# EAGLE design kbd (EAGLE 7.7.0)
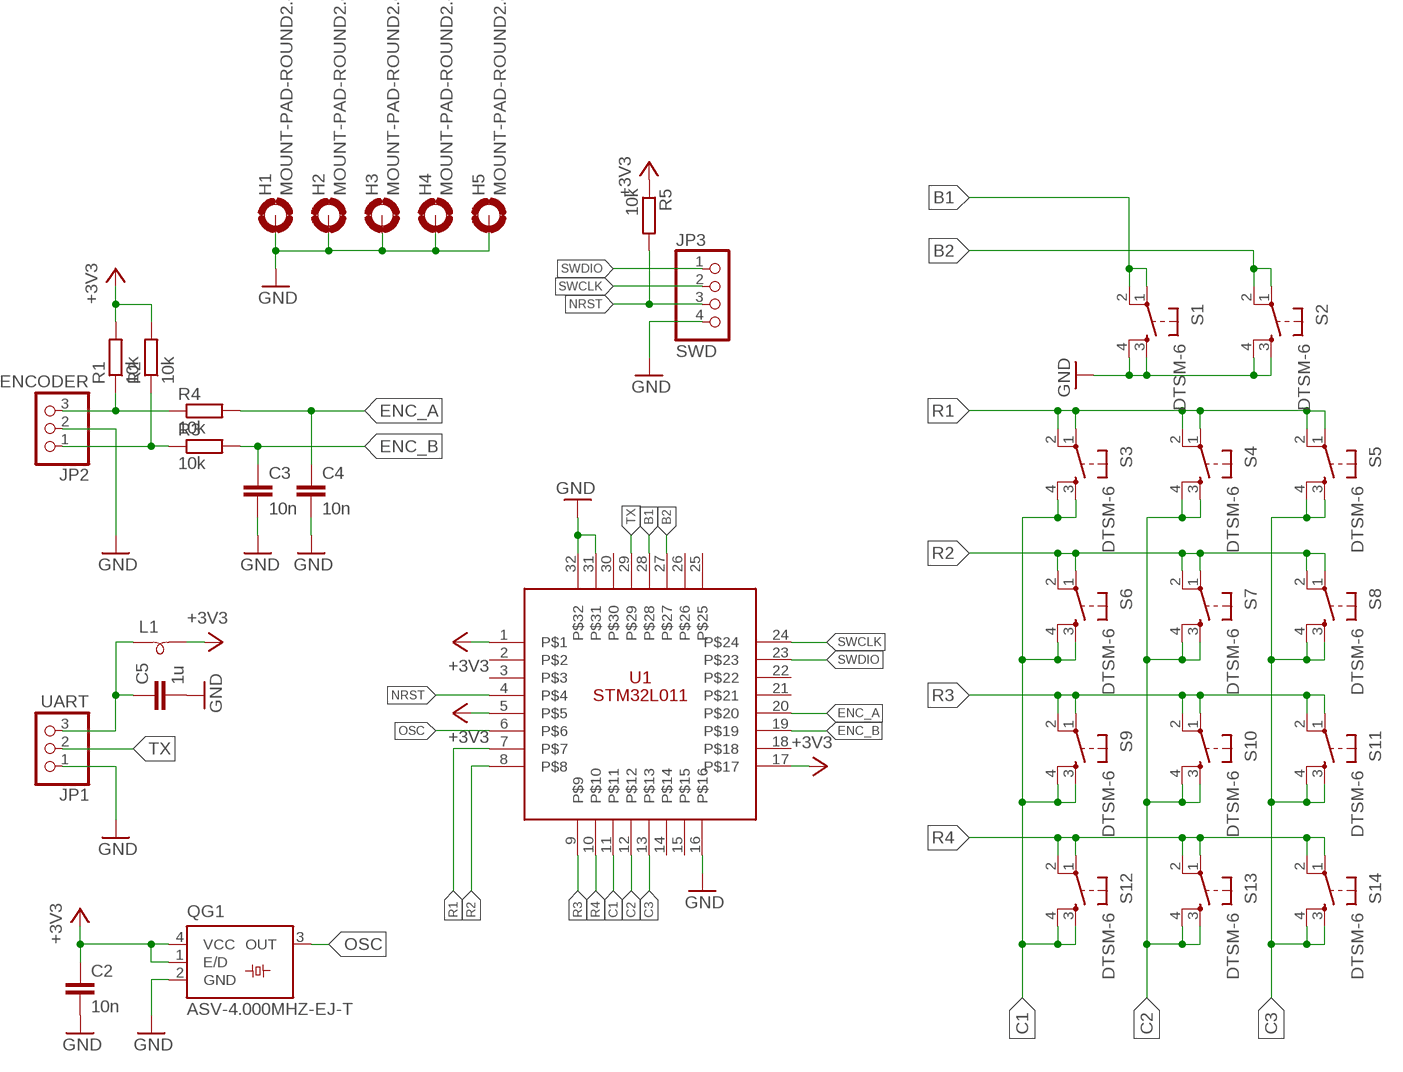
[diagram p0: schematic, sheet 1]

## Parts
C2  10n  C-EUC0805  [C0805]
C3  10n  C-EUC0805  [C0805]
C4  10n  C-EUC0805  [C0805]
C5  1u  C-EUC1206  [C1206]
H1  MOUNT-PAD-ROUND2.8  [2,8-PAD]
H2  MOUNT-PAD-ROUND2.8  [2,8-PAD]
H3  MOUNT-PAD-ROUND2.8  [2,8-PAD]
H4  MOUNT-PAD-ROUND2.8  [2,8-PAD]
H5  MOUNT-PAD-ROUND2.8  [2,8-PAD]
JP1  UART  PINHD-1X3  [1X03]
JP2  ENCODER  PINHD-1X3  [1X03]
JP3  SWD  PINHD-1X4  [1X04]
L1  SM-B5  [SM-B5]
QG1  ASV-4.000MHZ-EJ-T  SM77H  [SM77H]
R1  10k  R-EU_R0805  [R0805]
R2  10k  R-EU_R0805  [R0805]
R3  10k  R-EU_R0805  [R0805]
R4  10k  R-EU_R0805  [R0805]
R5  10k  R-EU_R0805  [R0805]
S1  DTSM-6  [DTSM-6]
S2  DTSM-6  [DTSM-6]
S3  DTSM-6  [DTSM-6]
S4  DTSM-6  [DTSM-6]
S5  DTSM-6  [DTSM-6]
S6  DTSM-6  [DTSM-6]
S7  DTSM-6  [DTSM-6]
S8  DTSM-6  [DTSM-6]
S9  DTSM-6  [DTSM-6]
S10  DTSM-6  [DTSM-6]
S11  DTSM-6  [DTSM-6]
S12  DTSM-6  [DTSM-6]
S13  DTSM-6  [DTSM-6]
S14  DTSM-6  [DTSM-6]
U1  STM32L011  [LQFP32-7X7]

## Nets
+3V3: C2.1 L1.2 QG1.1(E/D) QG1.4(VCC) R1.2 R2.2 R5.1 U1.1 U1.5 U1.17
B1: S1.1 S1.2 U1.28
B2: S2.1 S2.2 U1.27
C1: S3.3 S3.4 S6.3 S6.4 S9.3 S9.4 S12.3 S12.4 U1.11
C2: S4.3 S4.4 S7.3 S7.4 S10.3 S10.4 S13.3 S13.4 U1.12
C3: S5.3 S5.4 S8.3 S8.4 S11.3 S11.4 S14.3 S14.4 U1.13
ENC_A: C4.1 R4.2 U1.20
ENC_B: C3.1 R3.2 U1.19
GND: C2.2 C3.2 C4.2 C5.2 H1.B2,8(MOUNT) H2.B2,8(MOUNT) H3.B2,8(MOUNT) H4.B2,8(MOUNT) H5.B2,8(MOUNT) JP1.1 JP2.2 JP3.4 QG1.2(GND) S1.3 S1.4 S2.3 S2.4 U1.16 U1.31 U1.32
N$1: JP2.3 R1.1 R4.1
N$2: JP2.1 R2.1 R3.1
N$3: C5.1 JP1.3 L1.1
NRST: JP3.3 R5.2 U1.4
OSC: QG1.3(OUT) U1.6
R1: S3.1 S3.2 S4.1 S4.2 S5.1 S5.2 U1.7
R2: S6.1 S6.2 S7.1 S7.2 S8.1 S8.2 U1.8
R3: S9.1 S9.2 S10.1 S10.2 S11.1 S11.2 U1.9
R4: S12.1 S12.2 S13.1 S13.2 S14.1 S14.2 U1.10
SWCLK: JP3.2 U1.24
SWDIO: JP3.1 U1.23
TX: JP1.2 U1.29
Unconnected: U1.2 U1.3 U1.14 U1.15 U1.18 U1.21 U1.22 U1.25 U1.26 U1.30

## Library data of the parts
C2-C5 = rcl:C-EU: CAPACITOR, European symbol
H1-H5 = holes:MOUNT-PAD-ROUND: MOUNTING PAD, round
JP1 JP2 = pinhead:PINHD-1X3: PIN HEADER
JP3 = pinhead:PINHD-1X4: PIN HEADER
L1 = inductor-neosid:SM-B: INDUCTOR SMD Bead inductor; OC_FARNELL: unknown; OC_NEWARK: unknown
QG1 = crystal:SM77H: 3.3V CMOS Clock Oscillator Source: www.pletronics.com .. sm77h%203.3v.pdf; OC_FARNELL: unknown; OC_NEWARK: unknown
R1-R5 = rcl:R-EU_: RESISTOR, European symbol
S1-S14 = switch-tact:DTSM-6
U1 = STM32L011:STM32L011

## Net classes
0 default: width 0.254 mm, drill 0.2 mm, clearance 0.203 mm

## Board
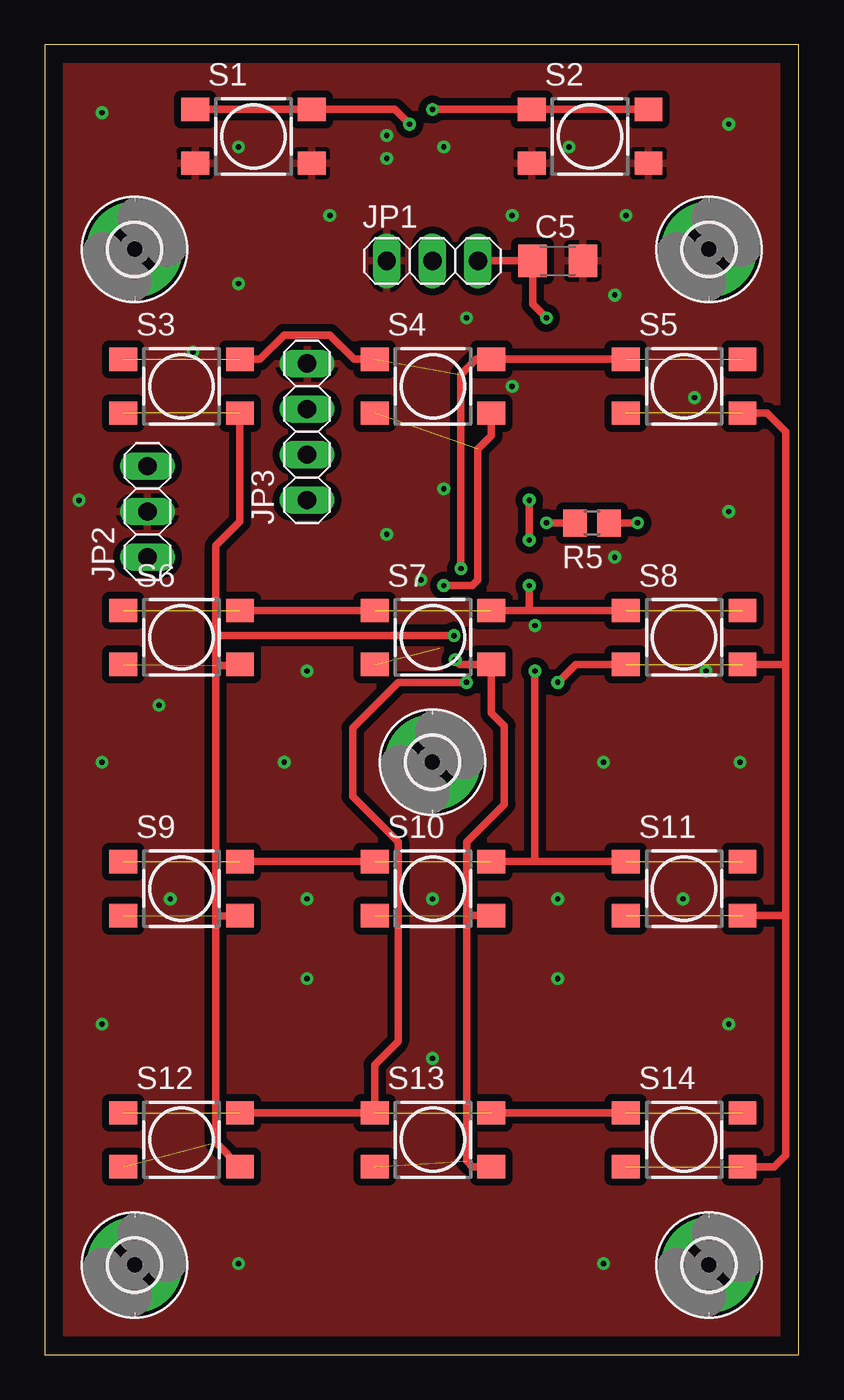
[diagram p1: board, top side]
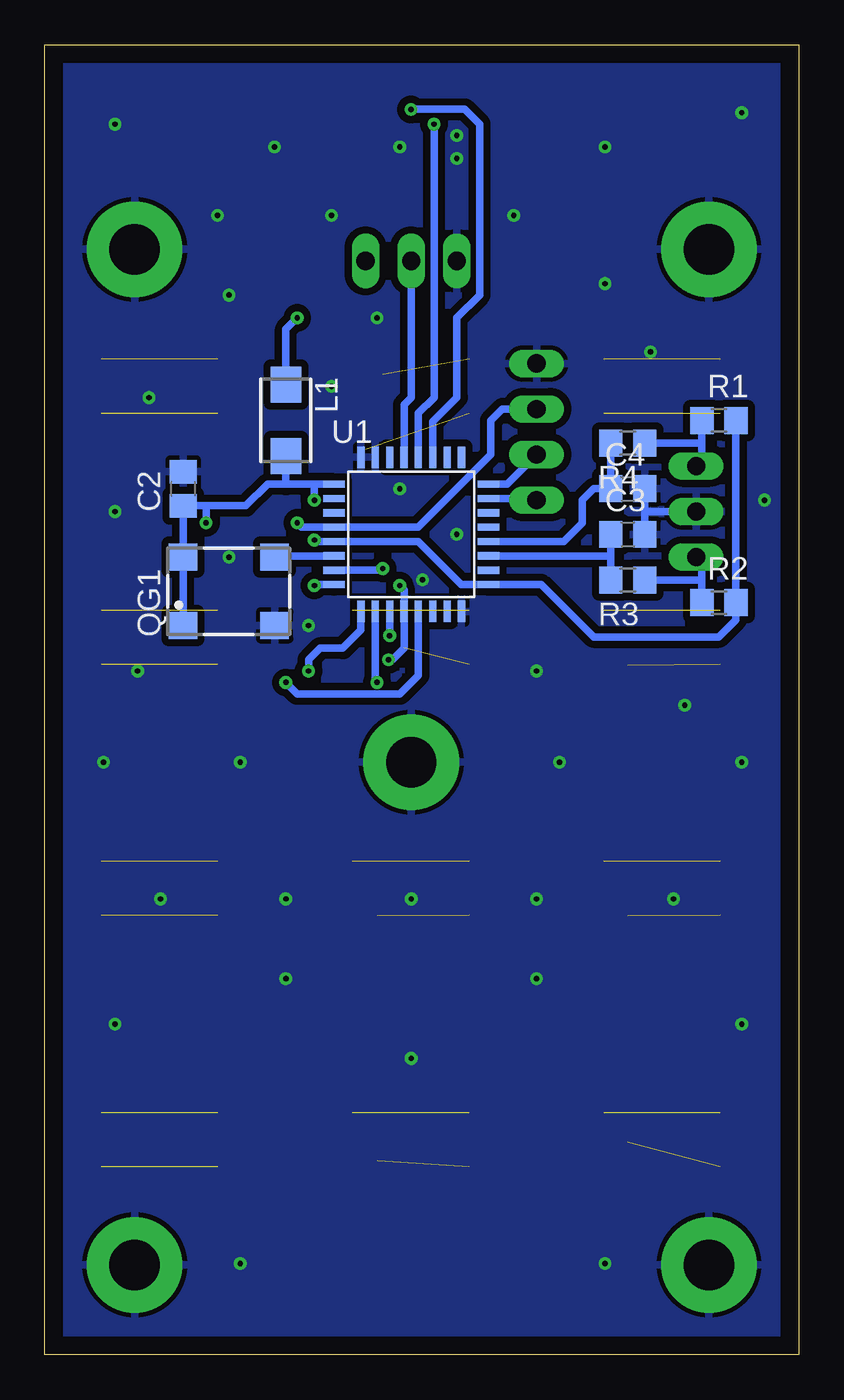
[diagram p2: board, bottom side, seen from below]

Size 42 x 73 mm. Coordinates in mm from the lower left corner, seen from the top.
Outline: 0,0 42,0 42,73 0,73 0,0
Copper layers (1*16): Top 0.035mm / dielectric 1.5mm / Bottom 0.035mm
Design rules "Moje Technoservice 2 *": minimum track width 5mil, minimum drill 0.2mm, track to track 5mil, track to pad 12mil, pad to pad 12mil, via to via 12mil, smd to smd 8mil, copper to edge 40mil, drill to drill 12mil, minimum pad ring 8mil, minimum via ring 8mil, stop-mask expansion 4mil, vias tented up to drill 0.3mm, thermal gap 10mil

### Footprints (pad centres in the part's own frame; a part is rotated, then mirrored left to right if it is on the bottom)
C0805 = smd 1.3 x 1.5: 1 -0.95,0; 2 0.95,0
C1206 = smd 1.6 x 1.8: 1 -1.4,0; 2 1.4,0
2,8-PAD = drill 2.8 pad 5.334: B2,8 0,0
1X03 = drill 1.016 long: 1 -2.54,0; 2 0,0; 3 2.54,0
1X04 = drill 1.016 long: 1 -3.81,0; 2 -1.27,0; 3 1.27,0; 4 3.81,0
SM-B5 = smd 2 x 1.7: 1 -2,0; 2 2,0
SM77H = smd 1.6 x 1.5: 1 -2.55,-1.9; 2 2.55,-1.9; 3 2.55,1.9; 4 -2.55,1.9
R0805 = smd 1.3 x 1.5: 1 -0.95,0; 2 0.95,0
DTSM-6 = smd 1.55 x 1.3: 1 -3.25,1.5; 2 3.25,1.5; 3 -3.25,-1.5; 4 3.25,-1.5
LQFP32-7X7 = smd 1.2 x 0.4: 1 -4.3,2.8; 2 -4.3,2; 3 -4.3,1.2; 4 -4.3,0.4; 5 -4.3,-0.4; 6 -4.3,-1.2; 7 -4.3,-2; 8 -4.3,-2.8; 17 4.3,-2.8; 18 4.3,-2; 19 4.3,-1.2; 20 4.3,-0.4; 21 4.3,0.4; 22 4.3,1.2; 23 4.3,2; 24 4.3,2.8 | smd 0.4 x 1.2: 9 -2.8,-4.3; 10 -2,-4.3; 11 -1.2,-4.3; 12 -0.4,-4.3; 13 0.4,-4.3; 14 1.2,-4.3; 15 2,-4.3; 16 2.8,-4.3; 25 2.8,4.3; 26 2,4.3; 27 1.2,4.3; 28 0.4,4.3; 29 -0.4,4.3; 30 -1.2,4.3; 31 -2,4.3; 32 -2.8,4.3

### Placement (x,y rotation side)
C2  34.29,48.26 90 bottom
C3  9.53,45.72 0 bottom
C4  9.53,48.26 0 bottom
C5  28.57,60.96 0 top
H1  5,5 0 top
H2  37,5 0 top
H3  37,61.6 0 top
H4  21.59,33.02 0 top
H5  5,61.6 0 top
JP1  21.59,60.96 0 top
JP2  5.71,46.99 90 top
JP3  14.61,51.44 90 top
L1  28.57,52.07 270 bottom
QG1  31.75,42.55 0 bottom
R1  4.45,52.07 0 bottom
R2  4.45,41.91 0 bottom
R3  9.53,43.18 180 bottom
R4  9.53,50.8 180 bottom
R5  30.48,46.35 180 top
S1  11.62,67.91 0 top
S2  30.38,67.91 0 top
S3  7.62,53.98 0 top
S4  21.62,53.98 0 top
S5  35.62,53.98 0 top
S6  7.62,39.98 0 top
S7  21.62,39.98 0 top
S8  35.62,39.98 0 top
S9  7.62,25.98 0 top
S10  21.62,25.98 0 top
S11  35.62,25.98 0 top
S12  7.62,11.97 0 top
S13  21.62,11.97 0 top
S14  35.62,11.97 0 top
U1  21.59,45.72 0 bottom

### Tracks (layer width: path | path; a pad name or v marks a point on that pad's centre or on a via)
+3V3  (via drill 0.3)
  Top 0.406: v26.99,45.4 v26.99,47.62 | R5.1 v33.02,46.35
  Bottom 0.406: R1.2 R2.2 3.5,40.95 4.45,40.01 11.43,40.01 14.35,42.92 U1.17 18.79,42.92 21.19,45.32 U1.5 26.91,45.32 v26.99,45.4 | U1.1 26.99,48.52 | 26.99,48.52 28.57,48.52 | 28.57,48.52 L1.2 | 33.02,47.31 C2.1 QG1.4 QG1.1 | 33.02,47.31 30.8,47.31 29.59,48.52 28.57,48.52 | v26.99,47.62 26.99,48.52 | v33.02,46.35 33.02,47.31
B1  (via drill 0.3)
  Top 0.406: S1.1 S1.2 19.5,69.41 v20.32,68.58
  Bottom 0.406: U1.28 21.19,52.47 20.32,53.34 v20.32,68.58
B2  (via drill 0.3)
  Top 0.406: S2.2 S2.1 v21.6,69.41
  Bottom 0.406: U1.27 20.39,52 19.05,53.34 19.05,57.78 17.78,59.05 17.78,68.58 18.61,69.41 v21.6,69.41
C1  (via drill 0.3)  (4 unrouted)
  Top 0.406: 9.53,40.01 9.53,45.09 10.87,46.43 S3.4 | 9.53,24.45 9.53,11.82 S12.4 | 9.53,24.45 9.53,38.42 | 9.53,38.42 9.53,40.01 | v22.79,40.08 9.6,40.08 9.53,40.01 | S9.4 10.84,24.45 9.53,24.45 | S6.4 10.81,38.42 9.53,38.42
  Bottom 0.406: U1.11 v22.79,40.08
C2  (via drill 0.3)  (4 unrouted)
  Top 0.406: 23.5,24.45 23.5,10.79 23.82,10.47 S13.4 | 23.5,24.45 23.5,28.57 25.59,30.68 25.59,35.05 24.87,35.77 S7.4 23.12,38.48 v22.86,38.73 | S10.4 23.52,24.48 23.5,24.45 | S4.4 24.87,51.22 24.13,50.48 24.13,43.18 23.81,42.86 v22.23,42.86
  Bottom 0.406: v22.86,38.73 22.62,38.73 21.99,39.37 U1.12 21.99,42.63 v22.23,42.86
C3  (via drill 0.3)  (4 unrouted)
  Top 0.406: 41.27,24.45 41.27,11.11 40.64,10.47 S14.4 | 41.27,24.45 41.27,38.42 | 41.27,38.42 41.27,51.44 40.23,52.48 S5.4 | S8.3 29.59,38.48 v28.57,37.47 | S8.4 41.22,38.48 41.27,38.42 | S11.4 41.25,24.48 41.27,24.45
  Bottom 0.406: U1.13 21.19,37.87 22.23,36.83 27.94,36.83 v28.57,37.47
ENC_A
  Bottom 0.406: R4.2 C4.1 11.43,48.26 12.06,47.62 12.06,46.35 13.1,45.32 U1.20
ENC_B
  Bottom 0.406: C3.1 10.47,44.45 | 10.47,44.45 R3.2 | U1.19 10.54,44.52 10.47,44.45
GND  (via drill 0.3)
  Bottom 0.406: C3.2 8.57,46.99 | 8.57,46.99 C4.2 | JP2.2 8.57,46.99
  other vias: 15.88,63.5 3.17,69.22 10.79,59.69 10.79,67.31 22.23,67.31 19.05,67.94 19.05,66.67 26.04,63.5 29.21,67.31 32.38,63.5 38.1,68.58 31.75,59.05 36.2,53.34 38.1,46.99 8.26,55.88 1.91,47.62 6.35,36.2 14.61,38.1 22.23,48.26 19.05,45.72 20.95,43.18 23.5,57.78 26.04,53.98 31.75,44.45 27.3,40.64 36.83,38.1 31.11,33.02 38.73,33.02 13.34,33.02 3.17,33.02 6.99,25.4 14.61,25.4 21.59,25.4 28.57,25.4 35.56,25.4 3.17,18.41 14.61,20.95 21.59,16.51 28.57,20.95 38.1,18.41 10.79,5.08 31.11,5.08
  pour Bottom (isolate 0.406): 0,73.66 42.55,73.66 42.55,-0.64 0,-0.64
  pour Top (isolate 0.406): 0,73.66 42.55,73.66 42.55,-0.64 0,-0.64
N$1
  Bottom 0.406: JP2.3 5.39,49.53 5.39,50.8 | 5.39,50.8 R1.1 | R4.1 5.39,50.8
N$2
  Bottom 0.406: JP2.1 5.39,44.45 5.39,43.18 | 5.39,43.18 R2.1 | R3.1 5.39,43.18
N$3  (via drill 0.3)
  Top 0.406: JP1.3 C5.1 27.18,58.55 v27.94,57.78
  Bottom 0.406: L1.1 28.57,57.15 v27.94,57.78
NRST  (via drill 0.3)
  Top 0.406: R5.2 v27.94,46.35
  Bottom 0.406: JP3.3 16.51,52.7 17.14,52.07 17.14,50.16 21.19,46.12 U1.4 27.7,46.12 v27.94,46.35
OSC
  Bottom 0.406: U1.6 29.12,44.52 QG1.3
R1  (via drill 0.3)  (3 unrouted)
  Top 0.406: S5.1 S4.2 24.04,55.48 23.18,54.61 v23.18,43.81 | S3.2 11.98,55.48 13.34,56.83 15.88,56.83 17.23,55.48 S4.1
  Bottom 0.406: U1.7 23.27,43.72 v23.18,43.81
R2  (via drill 0.3)  (3 unrouted)
  Top 0.406: S6.2 S7.1 | S7.2 26.99,41.48 | 26.99,41.48 S8.1 | 26.99,41.48 v26.99,42.86
  Bottom 0.406: U1.8 26.93,42.92 v26.99,42.86
R3  (via drill 0.3)  (3 unrouted)
  Top 0.406: S10.1 S9.2 | v27.3,38.1 27.3,27.48 | S10.2 27.3,27.48 | 27.3,27.48 S11.1
  Bottom 0.406: U1.9 24.39,40.38 25.4,39.37 26.67,39.37 27.3,38.73 v27.3,38.1
R4  (via drill 0.3)  (3 unrouted)
  Top 0.406: S12.2 S13.1 18.37,16.15 19.68,17.46 19.68,28.57 17.14,31.11 17.14,34.92 19.68,37.47 v23.5,37.47 | S14.1 S13.2
  Bottom 0.406: U1.10 23.59,37.56 v23.5,37.47
SWCLK
  Bottom 0.406: U1.24 16.25,48.52 JP3.2
SWDIO
  Bottom 0.406: JP3.1 14.61,47.72 U1.23
TX
  Bottom 0.406: U1.29 21.99,52.94 21.59,53.34 JP1.2

### Text on the board
tDocu: B1 | B2 | GND | TX | PWR | SWD | A | GND | ENCODER | B | TR_9_KBD_1.0 | TELETRA